# Altium schematic sheet TrebleBoost.SchDoc: Treble Boost
size A4; Author: Jeremiah Lilland; CompanyName: Pinebox Effects; DrawnBy: Jeremiah Lilland; Revision: 1.0; SheetNumber: 2; SheetTotal: 5; ProjectName: Booost
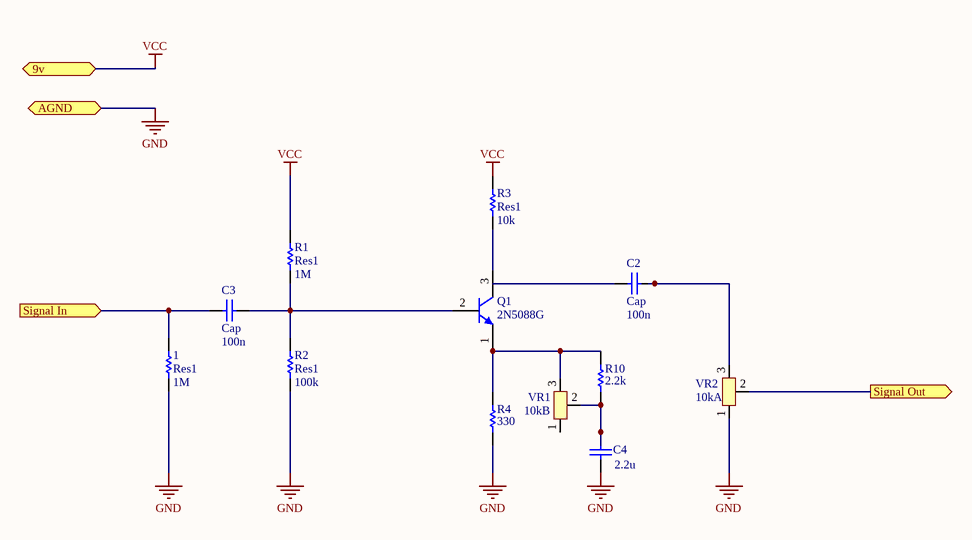
[diagram p0: TrebleBoost.SchDoc]

## Parts
1  Res1  value 1M  [AXIAL-0.3]
C2  Cap  value 100n  [RAD-0.3]
C3  Cap  value 100n  [RAD-0.3]
C4  value 2.2u  [RAD-0.3]  (hidden comment: Cap)
Q1  2N5088G  [ONSC-TO-92-3-29-11]
R1  Res1  value 1M  [AXIAL-0.3]
R2  Res1  value 100k  [AXIAL-0.3]
R3  Res1  value 10k  [AXIAL-0.3]
R4  value 330  [AXIAL-0.3]  (hidden comment: Res1)
R10  value 2.2k  [AXIAL-0.3]  (hidden comment: Res1)
VR1  value 10kB  [Pot-16mm]  (hidden comment: Pot-16mm)
VR2  value 10kA  [Pot-16mm]  (hidden comment: Pot-16mm)

## Ports
9v (bidir), AGND (bidir), Signal In (in), Signal Out (out)

## Nets
GND: 1.1 C4.1 R2.1 R4.1 VR2.1 ; port AGND
VCC: R1.2 R3.2 ; port 9v
Signal In: 1.2 C3.1 ; port Signal In
Signal Out: VR2.2 ; port Signal Out
NetC2_1: C2.1 VR2.3
NetC3_2: C3.2 Q1.2(B) R1.1 R2.2
NetC4_2: C4.2 R10.1 VR1.2
NetQ1_1: Q1.1(E) R4.2 R10.2 VR1.3
NetQ1_3: Q1.3(C) R3.1

Not connected (* = marked no-connect by the designer): C2 2; VR1 1

## Notes on the sheet
- Sheet Title:
- Project Title:
- Date:
- Revision:
- Sheet
- of
- File:

## Library data of the parts
1 R1-R4 R10 = Res1: Resistor; LatestRevisionDate: 17-Jul-2002; LatestRevisionNote: Re-released for DXP Platform.; PackageReference: AXIAL-0.3; Publisher: Altium Limited; PackageDescription: Axial Device, Thru-Hole; 2 Leads; 0.3 in Pin Spacing
  1 R1 R2 R4 R10: Published: 8-Jun-2000
C2-C4 = Cap: Capacitor; Published: 8-Jun-2000; LatestRevisionDate: 17-Jul-2002; LatestRevisionNote: Re-released for DXP Platform.; PackageReference: RAD-0.3; Publisher: Altium Limited; PackageDescription: Radial Cap, Thru-Hole; 2 Leads; 0.3 in Pin Spacing
Q1 = 2N5088G: Amplifier Transistor, NPN Silicon, 3-Pin TO-92, Pb-Free, Bulk Box; Manufacturer: On Semiconductor; fT Min (MHz): 50; IC Continuous (A): 0.05; DatasheetVersion: Rev. 4; PackageVersion: Rev. AM; PackageReference: TO-92-3-29-11_AM_SL; PackageDescription: 3-Pin Transistor Outline, Body 4.825 x 3.685 mm, Pitch 1.27 mm; Packing: Bulk Box; Polarity: NPN; RoHS: TRUE; Mounting Technology: Through Hole; PartNumber: 2N5088G; ComponentLink1Description: Manufacturer URL; ComponentLink1URL: http://www.onsemi.com/; ComponentLink2Description: Datasheet; ComponentLink2URL: http://www.onsemi.com/pub_link/Collateral/2N5088-D.PDF; ComponentLink3Description: Package Specification; ComponentLink3URL: http://www.onsemi.cn/pub_link/Collateral/2N6426-D.PDF; Supplier 1: Newark; Supplier Part Number 1: 42K3133; Supplier 2: Mouser; Supplier Part Number 2: 863-2N5088G
VR1 VR2 = Pot-16mm: Potentiometer 16mm